# EAGLE design 3WireLCD+keypadV5 (EAGLE 6.4)
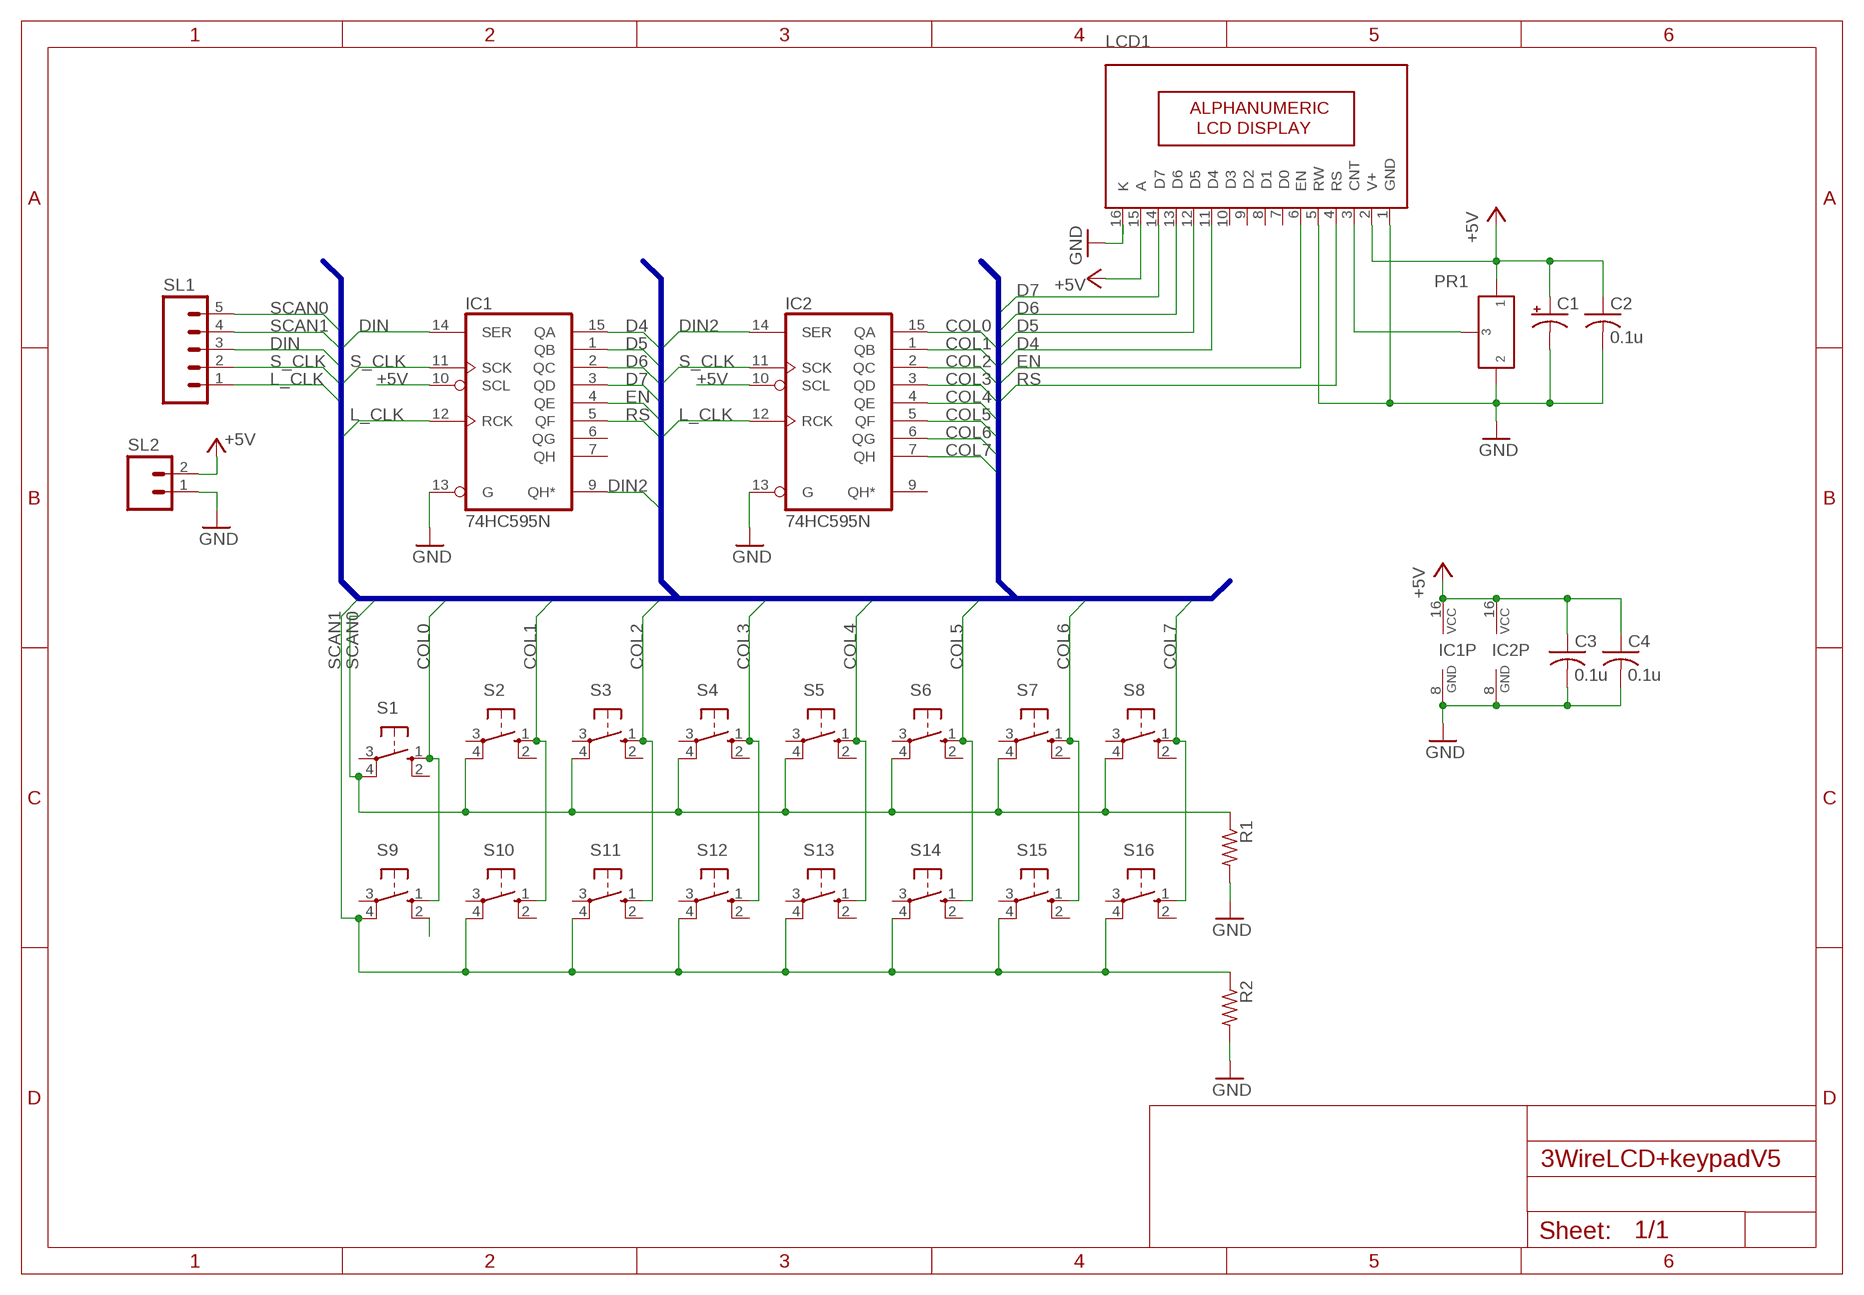
[diagram p0: schematic, sheet 1]

## Parts
C1  CAP_POL_16V  [B/3528-21R]
C2  0.1u  CAP0805  [C0805]
C3  0.1u  CAP0805  [C0805]
C4  0.1u  CAP0805  [C0805]
IC1  74HC595N  [DIL16]
IC2  74HC595N  [DIL16]
LCD1  16X2LCD  [16X2_LCD]
R1  RESISTOR0805  [R0805]
R2  RESISTOR0805  [R0805]
S1  40-XX  [B3F-40XX]
S2  40-XX  [B3F-40XX]
S3  40-XX  [B3F-40XX]
S4  40-XX  [B3F-40XX]
S5  40-XX  [B3F-40XX]
S6  40-XX  [B3F-40XX]
S7  40-XX  [B3F-40XX]
S8  40-XX  [B3F-40XX]
S9  40-XX  [B3F-40XX]
S10  40-XX  [B3F-40XX]
S11  40-XX  [B3F-40XX]
S12  40-XX  [B3F-40XX]
S13  40-XX  [B3F-40XX]
S14  40-XX  [B3F-40XX]
S15  40-XX  [B3F-40XX]
S16  40-XX  [B3F-40XX]
SL1  M05  [05P]
SL2  M02  [02P]
U$1  PRESET  [PRESET_PACK]

## Nets
+5V: C1.+ C2.1 C3.1 C4.1 IC1.10(SCL) IC1.16(VCC) IC2.10(SCL) IC2.16(VCC) LCD1.2(V+) LCD1.15(A) SL2.2 U$1.P$1
COL0: IC2.15(QA) S1.1(S) S9.1(S)
COL1: IC2.1(QB) S2.1(S) S10.1(S)
COL2: IC2.2(QC) S3.1(S) S11.1(S)
COL3: IC2.3(QD) S4.1(S) S12.1(S)
COL4: IC2.4(QE) S5.1(S) S13.1(S)
COL5: IC2.5(QF) S6.1(S) S14.1(S)
COL6: IC2.6(QG) S7.1(S) S15.1(S)
COL7: IC2.7(QH) S8.1(S) S16.1(S)
D4: IC1.15(QA) LCD1.11(D4)
D5: IC1.1(QB) LCD1.12(D5)
D6: IC1.2(QC) LCD1.13(D6)
D7: IC1.3(QD) LCD1.14(D7)
DIN: IC1.14(SER) SL1.3
DIN2: IC1.9(QH*) IC2.14(SER)
EN: IC1.4(QE) LCD1.6(EN)
GND [power]: C1.- C2.2 C3.2 C4.2 IC1.8(GND) IC1.13(G) IC2.8(GND) IC2.13(G) LCD1.1(GND) LCD1.5(RW) LCD1.16(K) R1.2 R2.2 SL2.1 U$1.P$2
L_CLK: IC1.12(RCK) IC2.12(RCK) SL1.1
N$3: LCD1.3(CNT) U$1.P$3
N$6: S9.2(S1)
RS: IC1.5(QF) LCD1.4(RS)
S_CLK: IC1.11(SCK) IC2.11(SCK) SL1.2
SCAN0: R1.1 S1.4(P1) S2.4(P1) S3.4(P1) S4.4(P1) S5.4(P1) S6.4(P1) S7.4(P1) S8.4(P1) SL1.5
SCAN1: R2.1 S9.4(P1) S10.4(P1) S11.4(P1) S12.4(P1) S13.4(P1) S14.4(P1) S15.4(P1) S16.4(P1) SL1.4
Unconnected: IC1.6(QG) IC1.7(QH) IC2.9(QH*) LCD1.7(D0) LCD1.8(D1) LCD1.9(D2) LCD1.10(D3) S1.2(S1) S1.3(P) S2.2(S1) S2.3(P) S3.2(S1) S3.3(P) S4.2(S1) S4.3(P) S5.2(S1) S5.3(P) S6.2(S1) S6.3(P) S7.2(S1) S7.3(P) S8.2(S1) S8.3(P) S9.3(P) S10.2(S1) S10.3(P) S11.2(S1) S11.3(P) S12.2(S1) S12.3(P) S13.2(S1) S13.3(P) S14.2(S1) S14.3(P) S15.2(S1) S15.3(P) S16.2(S1) S16.3(P)

## Buses
DIN,L_CLK,S_CLK,DIN2,D[4..7],EN,RS,COL[0..7],SCAN[0..1]

## Notes on the sheet
- PR1

## Library data of the parts
C1 = CEDTv77:CAP_POL
C2-C4 = CEDTv73:CAP
IC1 IC2 = 74xx-eu:74*595: 8-bit SHIFT REGISTER, output latch
LCD1 = CEDTv63:16X2LCD: ALPHANUMERIC-LCD
R1 R2 = CEDTv73:RESISTOR
S1-S16 = CEDTv77:40-XX: OMRON SWITCH
SL1 = con-amp-quick:M05: AMP QUICK CONNECTOR; OC_FARNELL: unknown; OC_NEWARK: unknown
SL2 = CEDTv69:M02: AMP QUICK CONNECTOR
U$1 = CEDTv63:PRESET

## Net classes
0 default: width 0.406 mm
1 power: width 0.61 mm

## Board
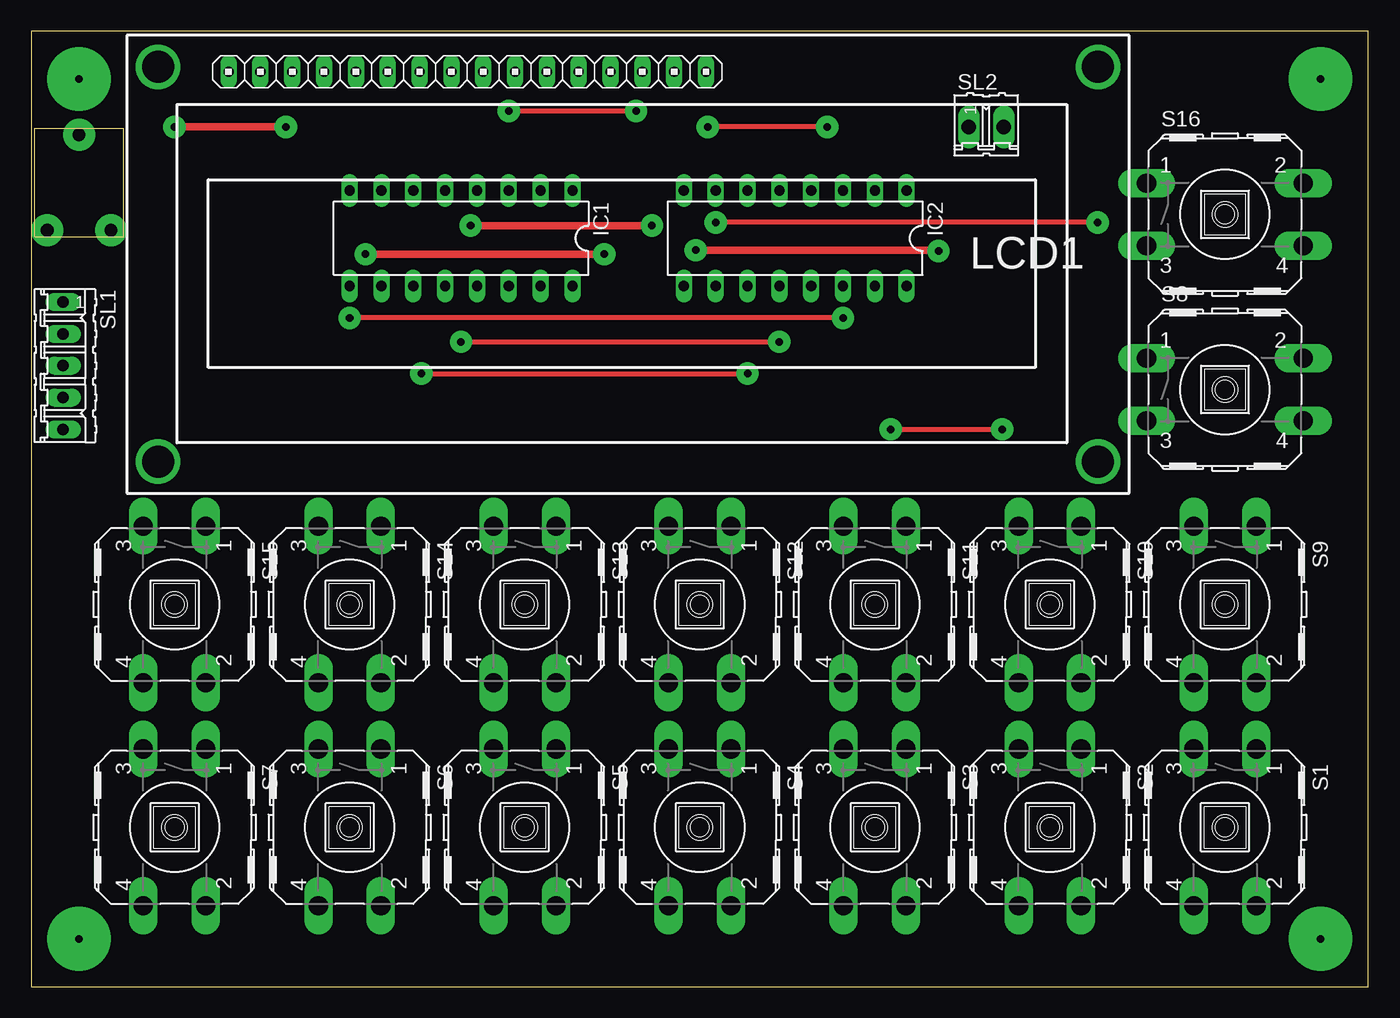
[diagram p1: board, top side]
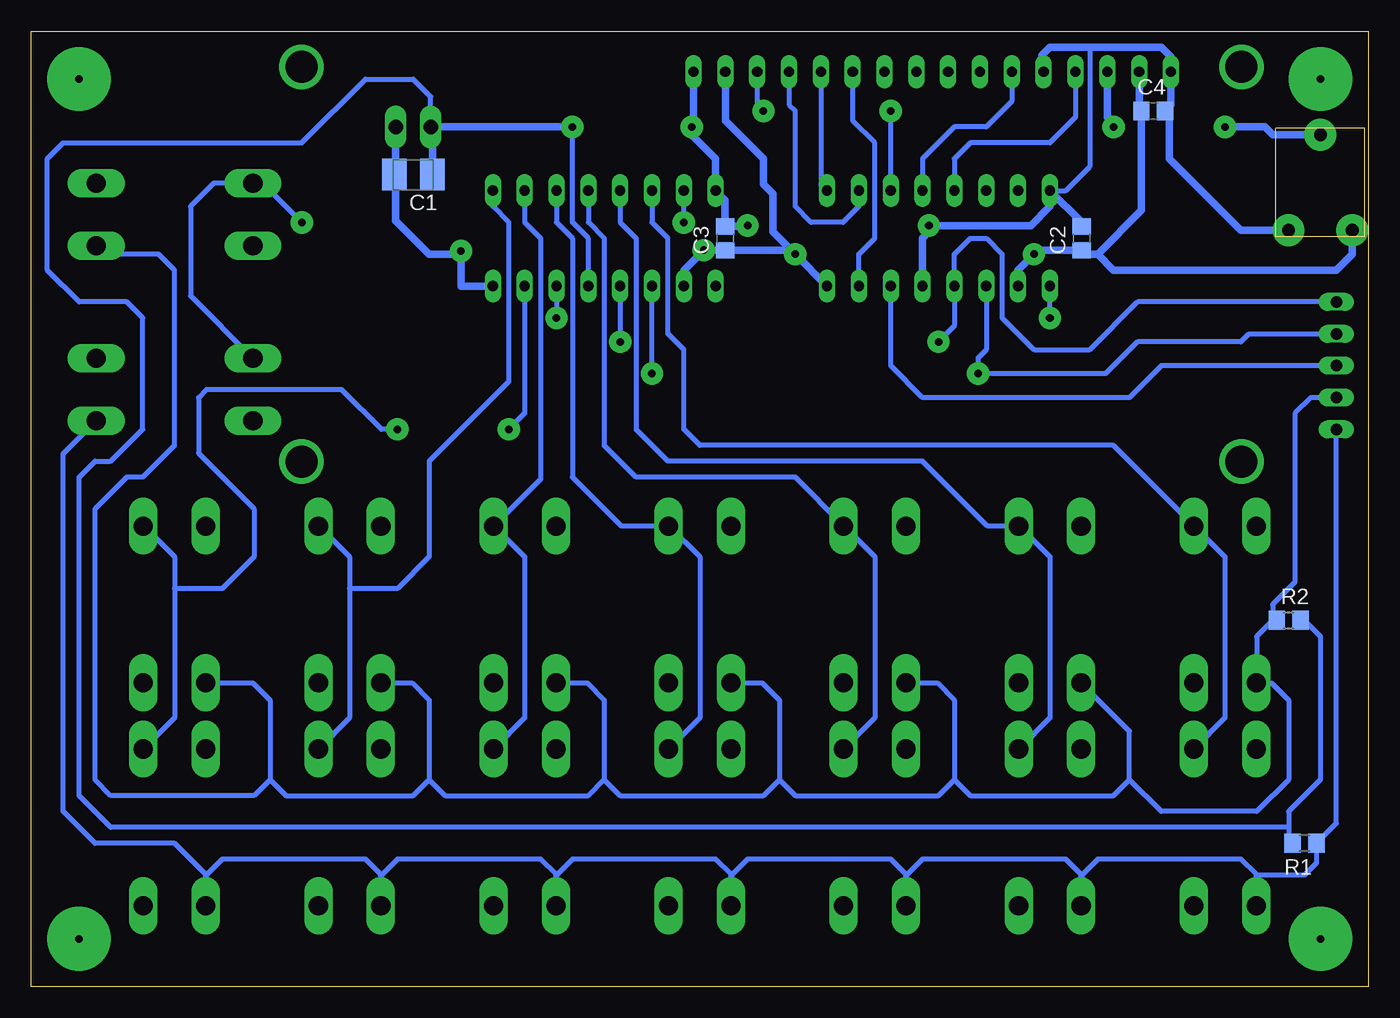
[diagram p2: board, bottom side, seen from below]

Size 106.68 x 76.2 mm. Coordinates in mm from the lower left corner, seen from the top.
Outline: 0,0 106.68,0 106.68,76.2 0,76.2 0,0
Copper layers (1*16): Top 0.035mm / dielectric 1.5mm / Bottom 0.035mm
Design rules "default": minimum track width 10mil, minimum drill 24mil, track to track 8mil, track to pad 8mil, pad to pad 8mil, via to via 8mil, smd to smd 8mil, copper to edge 40mil, drill to drill 8mil, minimum pad ring 10mil, minimum via ring 8mil, stop-mask expansion 4mil, vias tented up to drill 0mil, thermal gap 10mil

### Footprints (pad centres in the part's own frame; a part is rotated, then mirrored left to right if it is on the bottom)
B/3528-21R = smd 1.95 x 2.5: + 1.525,0; - -1.525,0
C0805 = smd 1.3 x 1.5: 1 -0.95,0; 2 0.95,0
DIL16 = drill 0.813 long: 1 -8.89,-3.81; 2 -6.35,-3.81; 3 -3.81,-3.81; 4 -1.27,-3.81; 5 1.27,-3.81; 6 3.81,-3.81; 7 6.35,-3.81; 8 8.89,-3.81; 9 8.89,3.81; 10 6.35,3.81; 11 3.81,3.81; 12 1.27,3.81; 13 -1.27,3.81; 14 -3.81,3.81; 15 -6.35,3.81; 16 -8.89,3.81
16X2_LCD = drill 0.813 long: 1 8.12,33.608; 2 10.66,33.608; 3 13.2,33.608; 4 15.74,33.608; 5 18.28,33.608; 6 20.82,33.608; 7 23.36,33.608; 8 25.9,33.608; 9 28.44,33.608; 10 30.98,33.608; 11 33.52,33.608; 12 36.06,33.608; 13 38.6,33.608; 14 41.14,33.608; 15 43.68,33.608; 16 46.22,33.608 | drill 2.54: P$1 2.5,34; P$2 2.5,2.5; P$3 77.5,2.5; P$4 77.5,34
R0805 = smd 1.3 x 1.5: 1 -0.95,0; 2 0.95,0
B3F-40XX = drill 1.524 long: 1 -6.248,2.489; 2 6.248,2.489; 3 -6.248,-2.489; 4 6.248,-2.489
05P = drill 0.914 long: 1 -5.08,0; 2 -2.54,0; 3 0,0; 4 2.54,0; 5 5.08,0
02P = drill 1.143 long: 1 -1.397,0; 2 1.397,0
PRESET_PACK = drill 1.016 pad 2.54: P$1 -2.54,-3.81; P$2 2.54,-3.81; P$3 0,3.81

### Placement (x,y rotation side)
C1  76.2,64.77 180 bottom
C2  22.86,59.69 90 bottom
C3  51.31,59.69 90 bottom
C4  17.14,69.85 0 bottom
IC1  34.29,59.69 180 top
IC2  60.96,59.69 180 top
LCD1  7.62,39.37 0 top
R1  5.08,11.43 180 bottom
R2  6.35,29.21 0 bottom
S1  95.25,12.7 270 top
S2  81.28,12.7 270 top
S3  67.31,12.7 270 top
S4  53.34,12.7 270 top
S5  39.37,12.7 270 top
S6  25.4,12.7 270 top
S7  11.43,12.7 270 top
S8  95.25,47.62 0 top
S9  95.25,30.48 270 top
S10  81.28,30.48 270 top
S11  67.31,30.48 270 top
S12  53.34,30.48 270 top
S13  39.37,30.48 270 top
S14  25.4,30.48 270 top
S15  11.43,30.48 270 top
S16  95.25,61.59 0 top
SL1  2.54,49.53 270 top
SL2  76.2,68.58 0 top
U$1  3.81,64.14 0 top

### Tracks (layer width: path | path; a pad name or v marks a point on that pad's centre or on a via)
+5V  (via drill 0.6 pad 1.78)
  Top 0.61: v26.67,58.42 v45.72,58.42 | v53.02,58.74 72.07,58.74 v72.39,58.67
  Bottom 0.61: IC2.10 54.61,57.15 v53.02,58.74 C3.1 46.04,58.74 v45.72,58.42 | LCD1.2 18.28,70.03 C4.1 18.09,61.91 21.59,58.42 | 21.59,58.42 22.54,58.42 C2.1 26.35,58.74 v26.67,58.42 27.94,57.15 IC1.10 | U$1.P$1 1.27,58.42 2.54,57.15 20.32,57.15 21.59,58.42 | v45.72,58.42 IC1.16 | IC2.16 72.39,55.88 v72.39,58.67 72.64,58.42 74.93,58.42 77.6,61.09 77.6,64.9 | LCD1.15 51.3,69.08 48.26,66.04 48.26,64.01 47.5,63.25 47.5,60.2 v45.72,58.42 | SL2.2 77.6,64.9 | 77.6,64.9 C1.+
COL0  (via drill 0.6 pad 1.78)
  Top 0.406: v68.58,44.45 v77.47,44.45
  Bottom 0.406: S9.1 97.69,36.73 95.25,34.29 95.25,31.75 | 95.25,31.75 95.25,21.44 S1.1 | IC2.15 67.31,45.72 v68.58,44.45 | v77.47,44.45 78.74,44.45 81.92,47.62 92.71,47.62 93.34,46.99 93.34,42.55 88.9,38.1 88.9,34.29 91.44,31.75 95.25,31.75
COL1
  Bottom 0.406: S10.1 83.72,36.73 81.28,34.29 81.28,31.75 | 81.28,31.75 81.28,21.44 S2.1 | IC2.1 69.85,62.23 68.58,60.96 68.58,48.26 74.93,41.91 74.93,34.29 77.47,31.75 81.28,31.75
COL2
  Bottom 0.406: S3.1 67.31,21.44 67.31,34.29 69.75,36.73 S11.1 66.04,40.49 66.04,59.69 67.31,60.96 IC2.2
COL3
  Bottom 0.406: S4.1 53.34,21.44 53.34,34.29 55.78,36.73 S12.1 59.59,36.73 63.5,40.64 63.5,59.69 64.77,60.96 IC2.3
COL4
  Bottom 0.406: S5.1 39.37,21.44 39.37,34.29 41.81,36.73 S13.1 41.86,36.78 45.72,40.64 58.42,40.64 60.96,43.18 60.96,59.69 62.23,60.96 IC2.4
COL5
  Bottom 0.406: S6.1 25.4,21.44 25.4,34.29 27.84,36.73 S14.1 30.38,36.73 35.56,41.91 55.88,41.91 58.42,44.45 58.42,59.69 59.69,60.96 IC2.5
COL6
  Bottom 0.406: S7.1 11.43,21.44 11.43,34.29 13.87,36.73 S15.1 13.92,36.78 20.32,43.18 53.34,43.18 54.61,44.45 54.61,50.8 55.88,52.07 55.88,59.69 57.15,60.96 IC2.6
COL7  (via drill 0.6 pad 1.78)
  Top 0.406: v85.09,60.96 v54.61,60.96
  Bottom 0.406: S8.1 93.98,55.09 93.98,62.23 92.13,64.08 S16.1 88.21,64.08 v85.09,60.96 | v54.61,60.96 IC2.7
D4
  Bottom 0.406: IC1.15 40.64,58.42 39.37,59.69 39.37,67.31 41.14,69.08 LCD1.11
D5
  Bottom 0.406: LCD1.12 43.68,64 IC1.1
D6
  Bottom 0.406: IC1.2 40.64,62.23 41.91,60.96 44.45,60.96 45.72,62.23 45.72,69.85 46.22,70.35 LCD1.13
D7  (via drill 0.6 pad 1.78)
  Top 0.406: v38.1,69.85 v48.26,69.85
  Bottom 0.406: IC1.3 v38.1,69.85 | LCD1.14 48.76,70.35 v48.26,69.85
DIN
  Bottom 0.406: SL1.3 16.51,49.53 19.05,46.99 35.56,46.99 38.1,49.53 IC1.14
DIN2  (via drill 0.6 pad 1.78)
  Top 0.406: v64.77,53.34 v25.4,53.34
  Bottom 0.406: IC2.14 v64.77,53.34 | v25.4,53.34 IC1.9
EN
  Bottom 0.406: LCD1.6 28.44,70.62 30.48,68.58 33.02,68.58 35.56,66.04 IC1.4
GND  (via drill 0.6 pad 1.78)
  Top 0.406: v63.5,68.58 v53.98,68.58
  Top 0.61: v49.53,60.71 v35.05,60.71
  Bottom 0.406: IC1.8 24.13,63.5 22.23,65.41 22.23,74.93 | LCD1.5 25.9,74.16 26.04,74.3 | IC2.13 62.23,59.69 63.5,60.96 v63.5,68.58 | v53.98,68.58 53.84,68.58 | 6.35,12.7 6.35,11.75 R1.2 | R2.2 5.08,29.21 3.81,27.94 3.81,16.51 6.35,13.97 6.35,12.7 | 6.35,12.7 100.33,12.7 102.87,15.24 102.87,40.64 101.6,41.91 100.33,41.91 97.79,44.45 97.79,53.34 99.06,54.61 102.87,54.61 105.41,57.15 105.41,66.04 104.14,67.31 85.09,67.31 80.01,72.39 76.2,72.39 74.8,70.99 SL2.1
  Bottom 0.61: C2.2 22.86,60.96 IC1.8 25.4,62.23 26.92,60.71 34.54,60.71 | LCD1.5 26.04,73.11 26.04,74.3 25.4,74.93 22.23,74.93 16.51,74.93 15.74,74.16 LCD1.1 15.74,70.31 C4.2 15.88,69.53 15.88,66.04 10.16,60.33 U$1.P$2 | LCD1.16 53.84,68.58 53.84,67.81 52.07,66.04 IC2.8 51.31,62.74 C3.2 49.6,60.64 v49.53,60.71 | v35.05,60.71 34.54,60.71 | 34.54,60.71 35.56,59.69 IC1.13 | v63.5,68.58 SL2.1 74.67,68.45 C1.-
L_CLK  (via drill 0.6 pad 1.78)
  Top 0.406: v34.29,51.44 v59.69,51.44
  Bottom 0.406: SL1.1 18.41,54.61 22.23,50.8 26.67,50.8 29.21,53.34 29.21,58.42 30.48,59.69 31.75,59.69 33.02,58.42 IC1.12 33.02,52.7 v34.29,51.44 | IC2.12 v59.69,51.44
N$1  (via drill 0.6 pad 5.08)
  other vias: 3.81,72.39
N$2  (via drill 0.6 pad 5.08)
  other vias: 102.87,72.39
N$3  (via drill 0.6 pad 1.78)
  Top 0.61: v20.32,68.58 v11.43,68.58
  Bottom 0.61: LCD1.3 20.82,69.35 v20.32,68.58 | v11.43,68.58 8.26,68.58 7.62,67.94 U$1.P$3
N$4  (via drill 0.6 pad 5.08)
  other vias: 102.87,3.81
N$5  (via drill 0.6 pad 5.08)
  other vias: 3.81,3.81
RS
  Bottom 0.406: LCD1.4 23.36,69.35 25.4,67.31 31.75,67.31 33.02,66.04 IC1.5
S_CLK  (via drill 0.6 pad 1.78)
  Top 0.406: v31.11,48.9 v57.15,48.9
  Bottom 0.406: SL1.2 9.53,52.07 10.16,51.44 18.41,51.44 20.95,48.9 v31.11,48.9 31.11,50.16 30.48,50.8 IC1.11 | v57.15,48.9 IC2.11
SCAN0
  Bottom 0.406: S7.4 8.94,8.89 | 8.94,8.89 8.94,8.94 10.16,10.16 21.59,10.16 22.86,8.89 22.86,6.5 S6.4 22.91,8.94 24.13,10.16 35.56,10.16 36.83,8.89 36.83,6.5 S5.4 36.88,8.94 38.1,10.16 49.53,10.16 50.8,8.89 50.8,6.5 S4.4 50.85,8.94 52.07,10.16 63.5,10.16 64.77,8.89 64.77,6.5 S3.4 64.82,8.94 66.04,10.16 77.47,10.16 78.74,8.89 78.74,6.5 S2.4 78.79,8.94 80.01,10.16 91.44,10.16 92.71,8.89 92.71,6.5 S1.4 92.76,8.94 95.25,11.43 101.6,11.43 104.14,13.97 104.14,42.49 S8.4 | SL1.5 2.54,13.02 R1.1 4.13,9.84 5.08,8.89 8.94,8.89
SCAN1
  Bottom 0.406: 19.05,16.51 16.51,13.97 8.89,13.97 6.35,16.51 6.35,22.86 7.72,24.23 S15.4 8.89,24.28 8.89,27.94 7.62,29.21 R2.1 7.62,29.53 7.62,30.48 5.84,32.26 5.84,45.72 4.57,46.99 SL1.4 | 19.05,16.51 19.05,20.37 S14.4 | S13.4 34.39,24.23 33.02,22.86 33.02,16.51 | 33.02,16.51 31.75,15.24 20.32,15.24 19.05,16.51 | S12.4 48.36,24.23 46.99,22.86 46.99,16.51 | 46.99,16.51 45.72,15.24 34.29,15.24 33.02,16.51 | S11.4 62.33,24.23 60.96,22.86 60.96,16.51 | 60.96,16.51 59.69,15.24 48.26,15.24 46.99,16.51 | S10.4 76.3,24.23 74.93,22.86 74.93,16.51 | 74.93,16.51 73.66,15.24 62.23,15.24 60.96,16.51 | 87.63,16.51 86.36,15.24 76.2,15.24 74.93,16.51 | S9.4 89,24.23 87.63,22.86 87.63,16.51 | 87.63,16.51 88.9,15.24 100.33,15.24 101.6,16.51 101.6,38.1 99.06,40.64 97.79,40.64 95.25,43.18 95.25,57.15 96.52,58.42 100.81,58.42 S16.4